# EAGLE design ControlBoardV2_PRO (EAGLE 9.6.2)
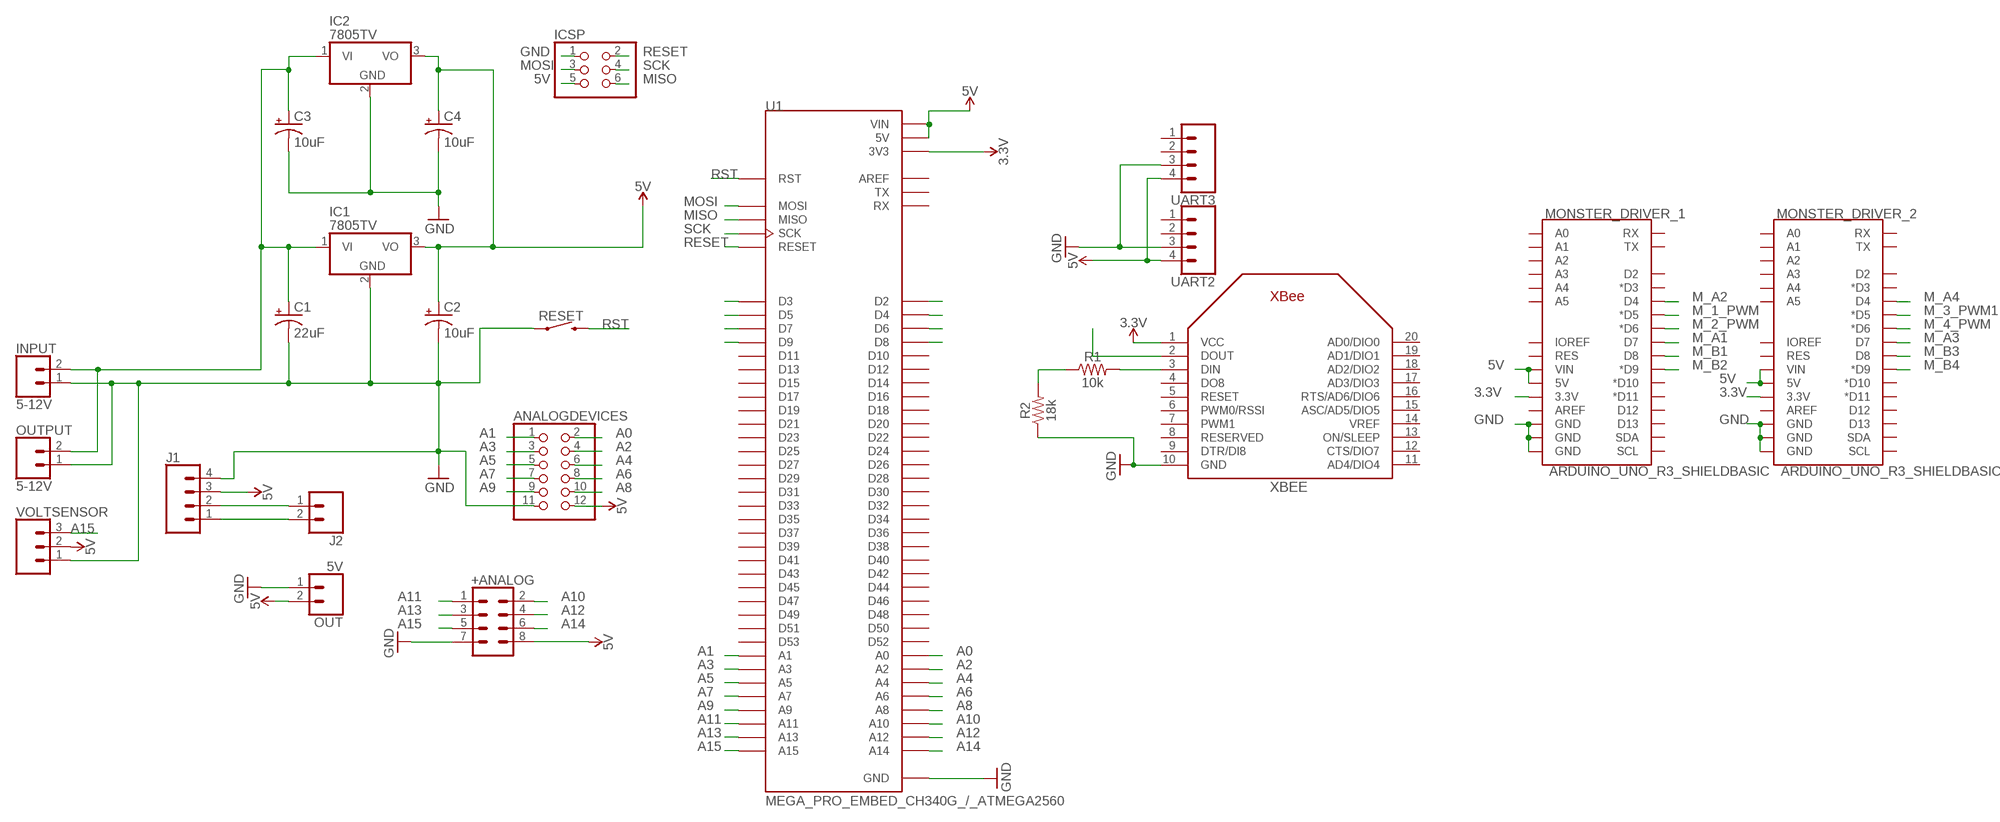
[diagram p0: schematic, sheet 1]

## Parts
+ANALOG  CONN_04X2  [2X4]
ANALOGDEVICES  PINHD-2X6  [2X06]
C1  22uF  CPOL-USE2.5-5  [E2,5-5]
C2  10uF  CPOL-USE2.5-5  [E2,5-5]
C3  10uF  CPOL-USE2.5-5  [E2,5-5]
C4  10uF  CPOL-USE2.5-5  [E2,5-5]
IC1  7805TV  [TO220V]
IC2  7805TV  [TO220V]
ICSP  PINHD-2X3  [2X03]
INPUT  5-12V  CONN_023.5MM  [SCREWTERMINAL-3.5MM-2]
J1  CONN_04  [1X04]
J2  CONN_02  [1X02]
MONSTER_DRIVER_1  ARDUINO_UNO_R3_SHIELDBASIC  [UNO_R3_SHIELD]
MONSTER_DRIVER_2  ARDUINO_UNO_R3_SHIELDBASIC  [UNO_R3_SHIELD]
OUT  5V  CONN_023.5MM  [SCREWTERMINAL-3.5MM-2]
OUTPUT  5-12V  CONN_023.5MM  [SCREWTERMINAL-3.5MM-2]
R1  10k  10KOHM-HORIZ-1/4W-1%  [AXIAL-0.3]
R2  18k  10KOHM-HORIZ-1/4W-1%  [AXIAL-0.3]
RESET  MOMENTARY-SWITCH-SPST-PTH-6.0MM  [TACTILE_SWITCH_PTH_6.0MM]
U1  MEGA_PRO_EMBED_CH340G_/_ATMEGA2560  [MODULE_MEGA_PRO_EMBED_CH340G_/_ATMEGA2560]
UART2  CONN_04  [1X04]
UART3  CONN_04  [1X04]
VOLTSENSOR  CONN_03  [1X03]
XBEE  XBEE  [XBEE]

## Nets
3.3V: MONSTER_DRIVER_1.3.3V MONSTER_DRIVER_2.3.3V U1.3V3_1(3V3) U1.3V3_2(3V3) XBEE.1(VCC)
5V: +ANALOG.8 ANALOGDEVICES.12 C2.+ C4.+ IC1.3(VO) IC2.3(VO) ICSP.5 J1.3 MONSTER_DRIVER_1.5V MONSTER_DRIVER_1.VIN MONSTER_DRIVER_2.5V MONSTER_DRIVER_2.VIN OUT.2 U1.5V_1(5V) U1.5V_2(5V) U1.5V_3(5V) U1.VIN_1(VIN) U1.VIN_2(VIN) UART2.4 UART3.4 VOLTSENSOR.2
A0: ANALOGDEVICES.2 U1.A0
A1: ANALOGDEVICES.1 U1.A1
A2: ANALOGDEVICES.4 U1.A2
A3: ANALOGDEVICES.3 U1.A3
A4: ANALOGDEVICES.6 U1.A4
A5: ANALOGDEVICES.5 U1.A5
A6: ANALOGDEVICES.8 U1.A6
A7: ANALOGDEVICES.7 U1.A7
A8: ANALOGDEVICES.10 U1.A8
A9: ANALOGDEVICES.9 U1.A9
A10: +ANALOG.2 U1.A10
A11: +ANALOG.1 U1.A11
A12: +ANALOG.4 U1.A12
A13: +ANALOG.3 U1.A13
A14: +ANALOG.6 U1.A14
A15: +ANALOG.5 U1.A15 VOLTSENSOR.3
GND: +ANALOG.7 ANALOGDEVICES.11 C1.- C2.- C3.- C4.- IC1.2(GND) IC2.2(GND) ICSP.1 INPUT.1 J1.4 MONSTER_DRIVER_1.GND@0(GND) MONSTER_DRIVER_1.GND@1(GND) MONSTER_DRIVER_1.GND@2(GND) MONSTER_DRIVER_2.GND@0(GND) MONSTER_DRIVER_2.GND@1(GND) MONSTER_DRIVER_2.GND@2(GND) OUT.1 OUTPUT.1 R2.P$1 RESET.1 U1.GND_1(GND) U1.GND_2(GND) U1.GND_3(GND) UART2.3 UART3.3 VOLTSENSOR.1 XBEE.10(GND)
M_1_PWM: MONSTER_DRIVER_1.D5(*D5)
M_2_PWM: MONSTER_DRIVER_1.D6(*D6)
M_3_PWM1: MONSTER_DRIVER_2.D5(*D5)
M_4_PWM: MONSTER_DRIVER_2.D6(*D6)
M_A1: MONSTER_DRIVER_1.D7
M_A2: MONSTER_DRIVER_1.D4
M_A3: MONSTER_DRIVER_2.D7
M_A4: MONSTER_DRIVER_2.D4
M_B1: MONSTER_DRIVER_1.D8
M_B2: MONSTER_DRIVER_1.D9(*D9)
M_B3: MONSTER_DRIVER_2.D8
M_B4: MONSTER_DRIVER_2.D9(*D9)
MISO: ICSP.6 U1.MISO
MISO1: U1.D4
MISO2: U1.D5
MOSI: ICSP.3 U1.MOSI
MOSI1: U1.D2
MOSI2: U1.D3
N$2: XBEE.2(DOUT)
N$7: R1.P$1 R2.P$2
N$9: R1.P$2 XBEE.3(DIN)
N$11: C1.+ C3.+ IC1.1(VI) IC2.1(VI) INPUT.2 OUTPUT.2
N$20: J1.1 J2.2
N$21: J1.2 J2.1
RESET: ICSP.2 U1.RESET
RESET1: U1.D8
RESET2: U1.D9
RST: RESET.3 U1.RST
SCK: ICSP.4 U1.SCK
SCK1: U1.D6
SCK2: U1.D7
Unconnected: MONSTER_DRIVER_1.A0 MONSTER_DRIVER_1.A1 MONSTER_DRIVER_1.A2 MONSTER_DRIVER_1.A3 MONSTER_DRIVER_1.A4 MONSTER_DRIVER_1.A5 MONSTER_DRIVER_1.AREF MONSTER_DRIVER_1.D2 MONSTER_DRIVER_1.D3(*D3) MONSTER_DRIVER_1.D10(*D10) MONSTER_DRIVER_1.D11(*D11) MONSTER_DRIVER_1.D12 MONSTER_DRIVER_1.D13 MONSTER_DRIVER_1.IOREF MONSTER_DRIVER_1.RES MONSTER_DRIVER_1.RX MONSTER_DRIVER_1.SCL MONSTER_DRIVER_1.SDA MONSTER_DRIVER_1.TX MONSTER_DRIVER_2.A0 MONSTER_DRIVER_2.A1 MONSTER_DRIVER_2.A2 MONSTER_DRIVER_2.A3 MONSTER_DRIVER_2.A4 MONSTER_DRIVER_2.A5 MONSTER_DRIVER_2.AREF MONSTER_DRIVER_2.D2 MONSTER_DRIVER_2.D3(*D3) MONSTER_DRIVER_2.D10(*D10) MONSTER_DRIVER_2.D11(*D11) MONSTER_DRIVER_2.D12 MONSTER_DRIVER_2.D13 MONSTER_DRIVER_2.IOREF MONSTER_DRIVER_2.RES MONSTER_DRIVER_2.RX MONSTER_DRIVER_2.SCL MONSTER_DRIVER_2.SDA MONSTER_DRIVER_2.TX U1.AREF U1.D10 U1.D11 U1.D12 U1.D13 U1.D14 U1.D15 U1.D16 U1.D17 U1.D18 U1.D19 U1.D20 U1.D21 U1.D22 U1.D23 U1.D24 U1.D25 U1.D26 U1.D27 U1.D28 U1.D29 U1.D30 U1.D31 U1.D32 U1.D33 U1.D34 U1.D35 U1.D36 U1.D37 U1.D38 U1.D39 U1.D40 U1.D41 U1.D42 U1.D43 U1.D44 U1.D45 U1.D46 U1.D47 U1.D48 U1.D49 U1.D50 U1.D51 U1.D52 U1.D53 U1.RX U1.TX UART2.1 UART2.2 UART3.1 UART3.2 XBEE.4(DO8) XBEE.5(RESET) XBEE.6(PWM0/RSSI) XBEE.7(PWM1) XBEE.8(RESERVED) XBEE.9(DTR/DI8) XBEE.11(AD4/DIO4) XBEE.12(CTS/DIO7) XBEE.13(ON/SLEEP) XBEE.14(VREF) XBEE.15(ASC/AD5/DIO5) XBEE.16(RTS/AD6/DIO6) XBEE.17(AD3/DIO3) XBEE.18(AD2/DIO2) XBEE.19(AD1/DIO1) XBEE.20(AD0/DIO0)

## Library data of the parts
+ANALOG = SparkFun-Connectors:CONN_04X2: Multi connection point. Often used as Generic Header-pin footprint for 0.1 inch spaced/style header connections On any of the 0.1 inch spaced packages, you can populate with these: Break Away Headers - Straight <https://www.sparkfun.com/products/116> (PRT-00116) Break Away Male Headers - Right Angle <https://www.sparkfun.com/products/553> (PRT-00553) Female Headers <https://www.sparkfun.com/products/115> (PRT-00115) Break Away Headers - Machine Pin <https://www.sparkfun.com/products/117> (PRT-00117) Break Away Female Headers - Swiss Machine Pin <https://www.sparkfun.com/products/743> (PRT-00743)
ANALOGDEVICES = pinhead:PINHD-2X6: PIN HEADER
C1-C4 = adafruit:CPOL-US: POLARIZED CAPACITOR, American symbol
IC1 IC2 = linear:78*: Positive VOLTAGE REGULATOR Source: http://cache.national.com/ds/LM/LM78L05.pdf http://www.fairchildsemi.com/ds/LM/LM7805.pdf
ICSP = pinhead:PINHD-2X3: PIN HEADER
INPUT OUT OUTPUT = SparkFun-Connectors:CONN_02: Multi connection point. Often used as Generic Header-pin footprint for 0.1 inch spaced/style header connections On any of the 0.1 inch spaced packages, you can populate with these: Break Away Headers - Straight <https://www.sparkfun.com/products/116> (PRT-00116) Break Away Male Headers - Right Angle <https://www.sparkfun.com/products/553> (PRT-00553) Female Headers <https://www.sparkfun.com/products/115> (PRT-00115) Break Away Headers - Machine Pin <https://www.sparkfun.com/products/117> (PRT-00117) Break Away Female Headers - Swiss Machine Pin <https://www.sparkfun.com/products/743> (PRT-00743) For SCREWTERMINALS and SPRING TERMINALS visit here: Screw Terimnals on SparkFun.com <https://www.sparkfun.com/search/results?term=Screw+Terminals> (5mm/3.5mm/2.54mm spacing) This device is also useful as a general connection point to wire up your design to another part of your project. Our various solder wires solder well into these plated through hole pads. Hook-Up Wire - Assortment (Stranded, 22 AWG) <https://www.sparkfun.com/products/11375> (PRT-11375) Hook-Up Wire - Assortment (Solid Core, 22 AWG) <https://www.sparkfun.com/products/11367> (PRT-11367) View the entire wire category on our website here <https://www.sparkfun.com/categories/141> Special notes: Molex polarized connector foot print use with: PRT-08233 with associated crimp pins and housings. 2.54_SCREWTERM for use with PRT-10571. 3.5mm Screw Terminal footprints for PRT-08084 5mm Screw Terminal footprints for use with PRT-08432; PROD_ID: CONN-08399
J1 UART2 UART3 = SparkFun-Connectors:CONN_04: Multi connection point. Often used as Generic Header-pin footprint for 0.1 inch spaced/style header connections On any of the 0.1 inch spaced packages, you can populate with these: Break Away Headers - Straight <https://www.sparkfun.com/products/116> (PRT-00116) Break Away Male Headers - Right Angle <https://www.sparkfun.com/products/553> (PRT-00553) Female Headers <https://www.sparkfun.com/products/115> (PRT-00115) Break Away Headers - Machine Pin <https://www.sparkfun.com/products/117> (PRT-00117) Break Away Female Headers - Swiss Machine Pin <https://www.sparkfun.com/products/743> (PRT-00743) For SCREWTERMINALS and SPRING TERMINALS visit here: Screw Terimnals on SparkFun.com <https://www.sparkfun.com/search/results?term=Screw+Terminals> (5mm/3.5mm/2.54mm spacing) This device is also useful as a general connection point to wire up your design to another part of your project. Our various solder wires solder well into these plated through hole pads. Hook-Up Wire - Assortment (Stranded, 22 AWG) <https://www.sparkfun.com/products/11375> (PRT-11375) Hook-Up Wire - Assortment (Solid Core, 22 AWG) <https://www.sparkfun.com/products/11367> (PRT-11367) View the entire wire category on our website here <https://www.sparkfun.com/categories/141> Special notes: Molex polarized connector foot print use with SKU : PRT-08231 with associated crimp pins and housings. 1MM SMD Version SKU: PRT-10208; PROD_ID: CONN-09696
J2 = SparkFun-Connectors:CONN_02: Multi connection point. Often used as Generic Header-pin footprint for 0.1 inch spaced/style header connections On any of the 0.1 inch spaced packages, you can populate with these: Break Away Headers - Straight <https://www.sparkfun.com/products/116> (PRT-00116) Break Away Male Headers - Right Angle <https://www.sparkfun.com/products/553> (PRT-00553) Female Headers <https://www.sparkfun.com/products/115> (PRT-00115) Break Away Headers - Machine Pin <https://www.sparkfun.com/products/117> (PRT-00117) Break Away Female Headers - Swiss Machine Pin <https://www.sparkfun.com/products/743> (PRT-00743) For SCREWTERMINALS and SPRING TERMINALS visit here: Screw Terimnals on SparkFun.com <https://www.sparkfun.com/search/results?term=Screw+Terminals> (5mm/3.5mm/2.54mm spacing) This device is also useful as a general connection point to wire up your design to another part of your project. Our various solder wires solder well into these plated through hole pads. Hook-Up Wire - Assortment (Stranded, 22 AWG) <https://www.sparkfun.com/products/11375> (PRT-11375) Hook-Up Wire - Assortment (Solid Core, 22 AWG) <https://www.sparkfun.com/products/11367> (PRT-11367) View the entire wire category on our website here <https://www.sparkfun.com/categories/141> Special notes: Molex polarized connector foot print use with: PRT-08233 with associated crimp pins and housings. 2.54_SCREWTERM for use with PRT-10571. 3.5mm Screw Terminal footprints for PRT-08084 5mm Screw Terminal footprints for use with PRT-08432
MONSTER_DRIVER_1 MONSTER_DRIVER_2 = SparkFun-Boards:ARDUINO_UNO_R3_SHIELD: Arduino R3 Shield Footprint Shield form compatible with the Arduino Uno R3. SparkFun Products: MG2639 Cellular Shield <https://www.sparkfun.com/products/13120> MIDI Shield <https://www.sparkfun.com/products/12898> R3 Stackable Headers Kit <https://www.sparkfun.com/products/11417>
R1 = SparkFun-Resistors:10KOHM: 10kΩ resistor A resistor is a passive two-terminal electrical component that implements electrical resistance as a circuit element. Resistors act to reduce current flow, and, at the same time, act to lower voltage levels within circuits. - Wikipedia; PROD_ID: RES-12183
R2 = SparkFun-Resistors:10KOHM: 10kΩ resistor A resistor is a passive two-terminal electrical component that implements electrical resistance as a circuit element. Resistors act to reduce current flow, and, at the same time, act to lower voltage levels within circuits. - Wikipedia; PROD_ID: RES-12183; VALUE: 10k
RESET = SparkFun-Switches:MOMENTARY-SWITCH-SPST: Momentary Switch (Pushbutton) - SPST Normally-open (NO) SPST momentary switches (buttons, pushbuttons). Variants PTH-12MM - 12mm square, through-hole Momentary Pushbutton Switch - 12mm Square <https://www.sparkfun.com/products/9190> (COM-09190) PTH-6.0MM, PTH-6.0MM-KIT - 6.0mm square, through-hole Mini Pushbutton Switch <https://www.sparkfun.com/products/97> (COM-00097) KIT package intended for soldering kit's - only one side of pads' copper is exposed. PTH-RIGHT-ANGLE-KIT - Right-angle, through-hole Right Angle Tactile Button <https://www.sparkfun.com/products/10791> - Used on SparkFun BigTime Watch Kit <https://www.sparkfun.com/products/11734> SMD-12MM - 12mm square, surface-mount Tactile Button - SMD (12mm) <https://www.sparkfun.com/products/12993> (COM-12993) Used on SparkFun PicoBoard <https://www.sparkfun.com/products/11888> SMD-4.5MM - 4.5mm Square Trackball Switch Used on SparkFun Blackberry Trackballer Breakout <https://www.sparkfun.com/products/13169> SMD-4.6MMX2.8MM - 4.60mm x 2.80mm, surface mount Used on SparkFun SAMD21 Mini Breakout <https://www.sparkfun.com/products/13664> SMD-5.2MM, SMD-5.2-REDUNDANT - 5.2mm square, surface-mount Mini Pushbutton Switch - SMD <https://www.sparkfun.com/products/8720> (COM-08720) Used on Arduino Pro Mini <https://www.sparkfun.com/products/11114> REDUNDANT package connects both switch circuits together SMD-6.0X3.5MM - 6.0 x 3.5mm, surface mount Momentary Reset Switch SMD <https://www.sparkfun.com/products/8229> (COM-08229) SMD-6.2MM-TALL - 6.2mm square, surface mount Tactile Button - SMD (6mm) <https://www.sparkfun.com/products/12992> Used on SparkFun Digital Sandbox <https://www.sparkfun.com/products/12651> SMD-RIGHT-ANGLE - Right-angle, surface mount Used on SparkFun Block for Intel® Edison - Arduino <https://www.sparkfun.com/products/13036>; PROD_ID: SWCH-08441; SF_SKU: COM-00097
U1 = MEGA_PRO_EMBED_CH340G___ATMEGA2560:MEGA_PRO_EMBED_CH340G_/_ATMEGA2560: Mega 2560 PRO (Embed) CH340G/ATmega2560-16AU Check availability <https://pricing.snapeda.com/parts/Mega%20Pro%20Embed%20CH340G%20/%20ATmega2560/Robotdyn/view-part?ref=eda>; AVAILABILITY: Not in stock; MF: Robotdyn; MP: Mega Pro Embed CH340G / ATmega2560; PACKAGE: None; PRICE: None
VOLTSENSOR = SparkFun-Connectors:CONN_03: Multi connection point. Often used as Generic Header-pin footprint for 0.1 inch spaced/style header connections On any of the 0.1 inch spaced packages, you can populate with these: Break Away Headers - Straight <https://www.sparkfun.com/products/116> (PRT-00116) Break Away Male Headers - Right Angle <https://www.sparkfun.com/products/553> (PRT-00553) Female Headers <https://www.sparkfun.com/products/115> (PRT-00115) Break Away Headers - Machine Pin <https://www.sparkfun.com/products/117> (PRT-00117) Break Away Female Headers - Swiss Machine Pin <https://www.sparkfun.com/products/743> (PRT-00743) Stackable Header - 3 Pin (Female, 0.1") <https://www.sparkfun.com/products/13875> (PRT-13875) For SCREWTERMINALS and SPRING TERMINALS visit here: Screw Terimnals on SparkFun.com <https://www.sparkfun.com/search/results?term=Screw+Terminals> (5mm/3.5mm/2.54mm spacing) This device is also useful as a general connection point to wire up your design to another part of your project. Our various solder wires solder well into these plated through hole pads. Hook-Up Wire - Assortment (Stranded, 22 AWG) <https://www.sparkfun.com/products/11375> (PRT-11375) Hook-Up Wire - Assortment (Solid Core, 22 AWG) <https://www.sparkfun.com/products/11367> (PRT-11367) View the entire wire category on our website here <https://www.sparkfun.com/categories/141> Special notes: Molex polarized connector foot print use with SKU : PRT-08232 with associated crimp pins and housings.
XBEE = adafruit:XBEE

## Board
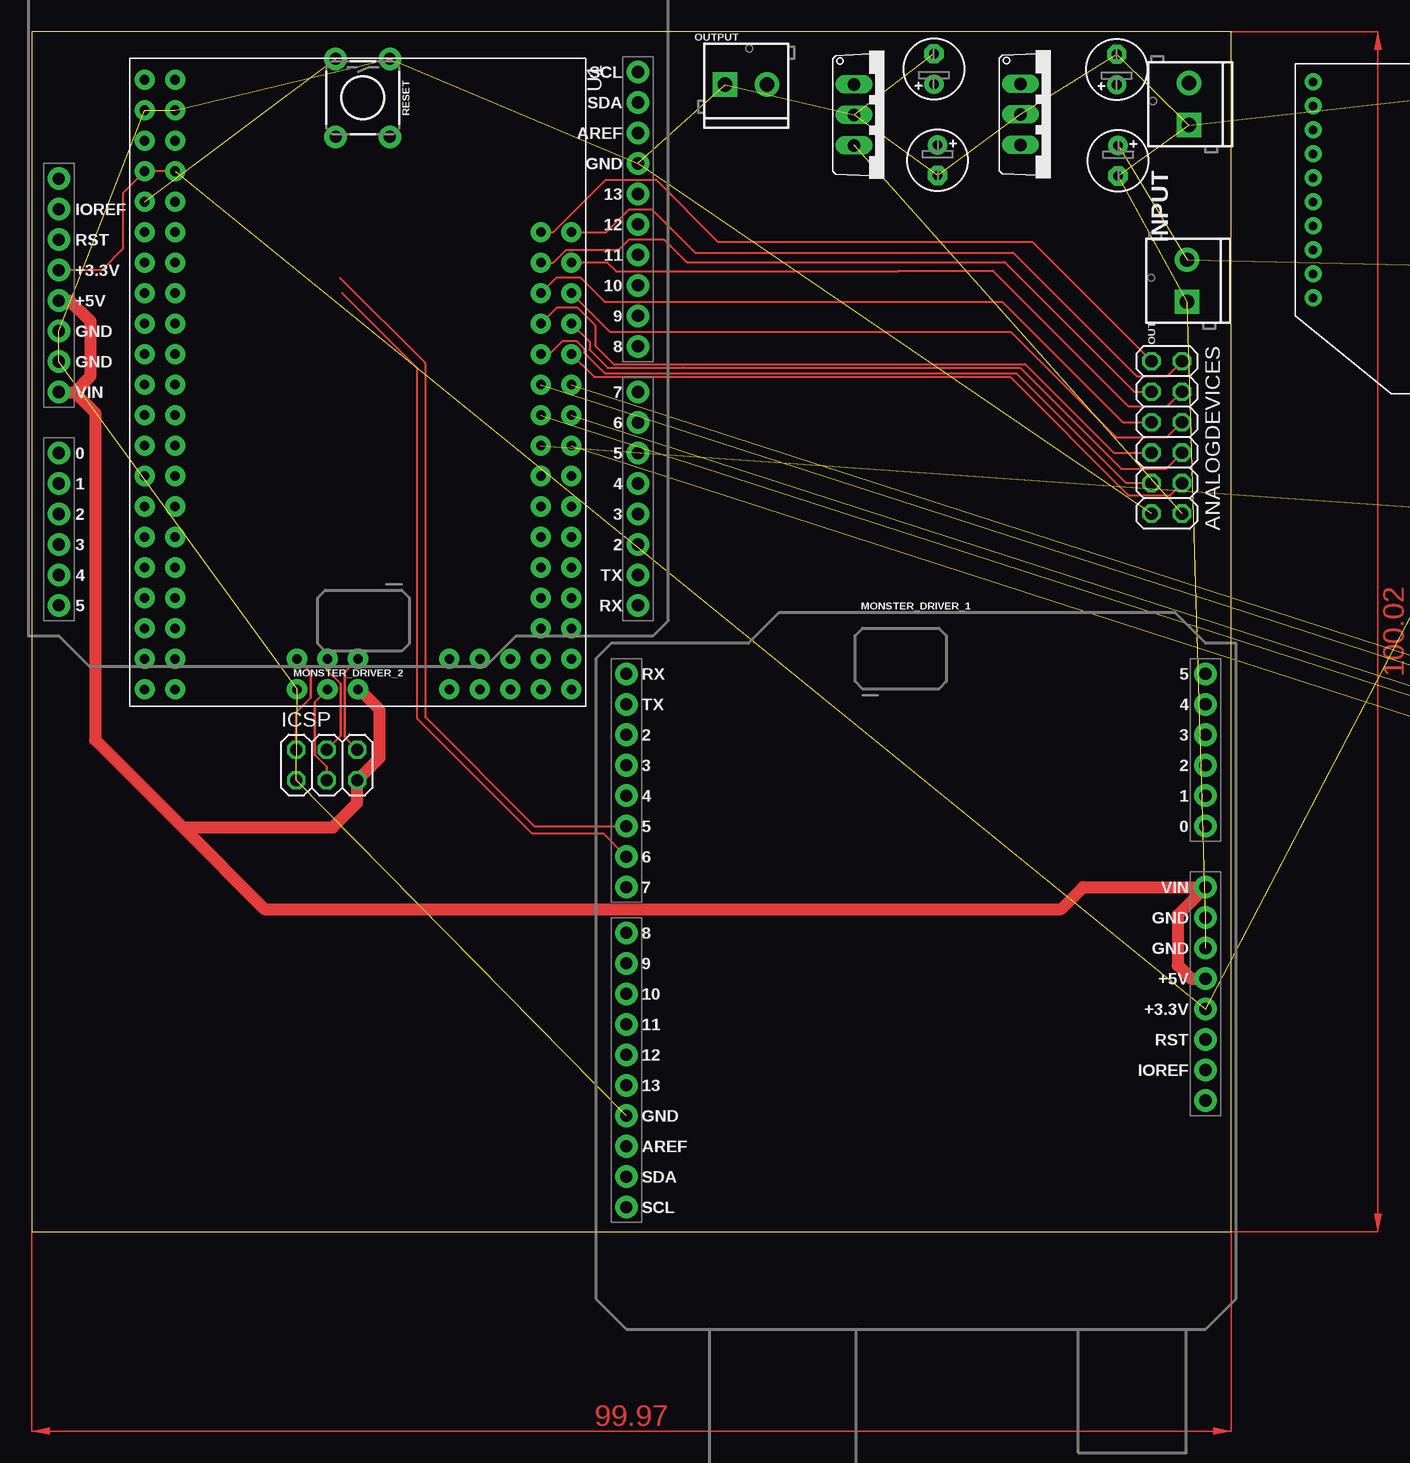
[diagram p1: board, top side]
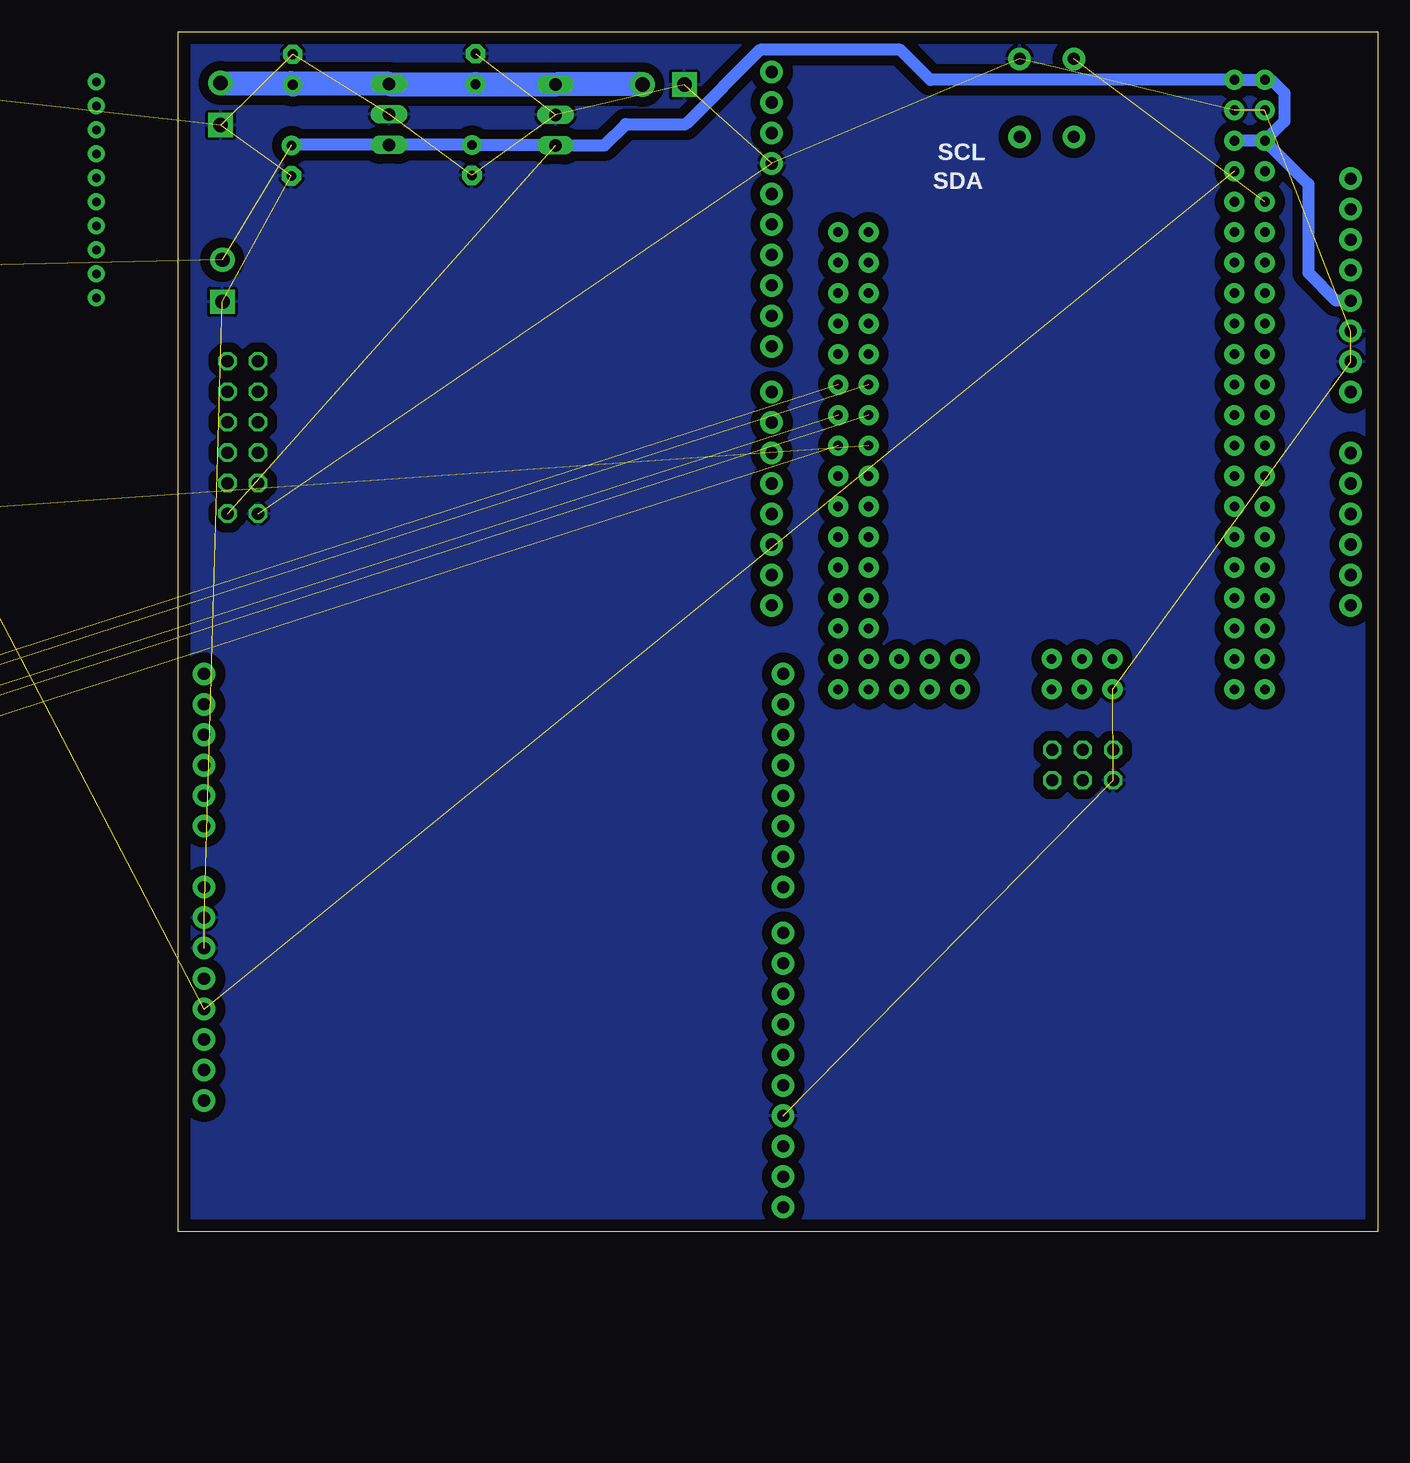
[diagram p2: board, bottom side, seen from below]

Size 99.97 x 100.02 mm. Coordinates in mm from the lower left corner, seen from the top.
Outline: 0,0 99.97,0 99.97,100.02 0,100.02 0,0
Copper layers (1*16): Top 0.035mm / dielectric 1.5mm / Bottom 0.035mm
Design rules "default *": minimum track width 6mil, minimum drill 0.3mm, track to track 6mil, track to pad 6mil, pad to pad 6mil, via to via 6mil, smd to smd 6mil, copper to edge 40mil, drill to drill 6mil, minimum pad ring 10mil, minimum via ring 8mil, stop-mask expansion 4mil, vias tented up to drill 0mil, thermal gap 10mil

### Footprints (pad centres in the part's own frame; a part is rotated, then mirrored left to right if it is on the bottom)
2X4 = drill 1.016 pad 1.88: 1 -3.81,-1.27; 2 -3.81,1.27; 3 -1.27,-1.27; 4 -1.27,1.27; 5 1.27,-1.27; 6 1.27,1.27; 7 3.81,-1.27; 8 3.81,1.27
2X06 = drill 1.016 octagon: 1 -6.35,-1.27; 2 -6.35,1.27; 3 -3.81,-1.27; 4 -3.81,1.27; 5 -1.27,-1.27; 6 -1.27,1.27; 7 1.27,-1.27; 8 1.27,1.27; 9 3.81,-1.27; 10 3.81,1.27; 11 6.35,-1.27; 12 6.35,1.27
E2,5-5 = drill 0.813 pad 1.6: + -1.27,0 | drill 0.813 pad 1.6 octagon: - 1.27,0
TO220V = drill 1.016 long: 1 -2.54,-2.54; 2 0,-2.54; 3 2.54,-2.54
2X03 = drill 1.016 octagon: 1 -2.54,-1.27; 2 -2.54,1.27; 3 0,-1.27; 4 0,1.27; 5 2.54,-1.27; 6 2.54,1.27
SCREWTERMINAL-3.5MM-2 = drill 1.2 pad 2.032 square: 1 0,0 | drill 1.2 pad 2.032: 2 3.5,0
1X04 = drill 1.016 pad 1.88: 1 0,0; 2 2.54,0; 3 5.08,0; 4 7.62,0
1X02 = drill 1.016 pad 1.88: 1 0,0; 2 2.54,0
UNO_R3_SHIELD = drill 1.016 pad 1.88: 3.3V 24.13,-2.54; 5V 24.13,0; A0 24.13,12.7; A1 24.13,15.24; A2 24.13,17.78; A3 24.13,20.32; A4 24.13,22.86; A5 24.13,25.4; AREF -24.13,-13.97; D2 -24.13,20.32; D3 -24.13,17.78; D4 -24.13,15.24; D5 -24.13,12.7; D6 -24.13,10.16; D7 -24.13,7.62; D8 -24.13,3.81; D9 -24.13,1.27; D10 -24.13,-1.27; D11 -24.13,-3.81; D12 -24.13,-6.35; D13 -24.13,-8.89; GND@0 24.13,2.54; GND@1 24.13,5.08; GND@2 -24.13,-11.43; IOREF 24.13,-7.62; NC 24.13,-10.16; RES 24.13,-5.08; RX -24.13,25.4; SCL -24.13,-19.05; SDA -24.13,-16.51; TX -24.13,22.86; VIN 24.13,7.62
AXIAL-0.3 = drill 0.9 pad 1.88: P$1 -3.81,0; P$2 3.81,0
TACTILE_SWITCH_PTH_6.0MM = drill 1.016 pad 1.88: 1 -3.251,2.261; 2 3.251,2.261; 3 -3.251,-2.261; 4 3.251,-2.261
MODULE_MEGA_PRO_EMBED_CH340G_/_ATMEGA2560 = drill 0.8 pad 1.676: 3V3_1 -17.58,-17.78; 3V3_2 -17.58,-15.24; 5V_1 -20.12,-17.78; 5V_2 -20.12,-15.24; 5V_3 25.6,0; A0 -12.5,17.78; A1 -12.5,15.24; A2 -9.96,17.78; A3 -9.96,15.24; A4 -7.42,17.78; A5 -7.42,15.24; A6 -4.88,17.78; A7 -4.88,15.24; A8 -2.34,17.78; A9 -2.34,15.24; A10 0.2,17.78; A11 0.2,15.24; A12 2.74,17.78; A13 2.74,15.24; A14 5.28,17.78; A15 5.28,15.24; AREF -15.04,-15.24; D2 -9.96,-15.24; D3 -9.96,-17.78; D4 -7.42,-15.24; D5 -7.42,-17.78; D6 -4.88,-15.24; D7 -4.88,-17.78; D8 -2.34,-15.24; D9 -2.34,-17.78; D10 0.2,-15.24; D11 0.2,-17.78; D12 2.74,-15.24; D13 2.74,-17.78; D14 5.28,-15.24; D15 5.28,-17.78; D16 7.82,-15.24; D17 7.82,-17.78; D18 10.36,-15.24; D19 10.36,-17.78; D20 12.9,-15.24; D21 12.9,-17.78; D22 15.44,-15.24; D23 15.44,-17.78; D24 17.98,-15.24; D25 17.98,-17.78; D26 20.52,-15.24; D27 20.52,-17.78; D28 23.06,-15.24; D29 23.06,-17.78; D30 25.6,-15.24; D31 25.6,-17.78; D32 7.82,17.78; D33 7.82,15.24; D34 10.36,17.78; D35 10.36,15.24; D36 12.9,17.78; D37 12.9,15.24; D38 15.44,17.78; D39 15.44,15.24; D40 17.98,17.78; D41 17.98,15.24; D42 20.52,17.78; D43 20.52,15.24; D44 23.06,17.78; D45 23.06,15.24; D46 25.6,17.78; D47 25.6,15.24; D48 25.6,12.7; D49 23.06,12.7; D50 25.6,10.16; D51 23.06,10.16; D52 25.6,7.62; D53 23.06,7.62; GND_1 -22.66,-17.78; GND_2 -22.66,-15.24; GND_3 25.6,-5.08; MISO 23.06,0; MOSI 25.6,-2.54; RESET 23.06,-5.08; RST -15.04,-17.78; RX -12.5,-15.24; SCK 23.06,-2.54; TX -12.5,-17.78; VIN_1 -25.2,-17.78; VIN_2 -25.2,-15.24
1X03 = drill 1.016 pad 1.88: 1 0,0; 2 2.54,0; 3 5.08,0
XBEE = drill 0.7 pad 1.422 square: 1 -11,5.5 | drill 0.7 pad 1.422: 2 -11,3.5; 3 -11,1.5; 4 -11,-0.5; 5 -11,-2.5; 6 -11,-4.5; 7 -11,-6.5; 8 -11,-8.5; 9 -11,-10.5; 10 -11,-12.5; 11 11,-12.5; 12 11,-10.5; 13 11,-8.5; 14 11,-6.5; 15 11,-4.5; 16 11,-2.5; 17 11,-0.5; 18 11,1.5; 19 11,3.5; 20 11,5.5

### Placement (x,y rotation side)
+ANALOG  165.9,27.4 270 top  (outside the outline)
ANALOGDEVICES  94.6,66.2 270 top
C1  90.43,96.86 90 top
C2  90.54,89.26 270 top
C3  75.2,96.9 90 top
C4  75.5,89.3 270 top
IC1  84.95,93.11 270 top
IC2  71.08,93.07 270 top
ICSP  24.6,38.9 0 top
INPUT  96.45,92.23 90 top
J1  154.4,72.1 90 top  (outside the outline)
J2  194.4,97 270 top  (outside the outline)
MONSTER_DRIVER_1  73.7,21.1 0 top
MONSTER_DRIVER_2  26.4,77.6 180 top
OUT  96.3,77.5 90 top
OUTPUT  57.8,95.6 0 top
R1  167.02,46.66 270 top  (outside the outline)
R2  159.26,50.26 0 top  (outside the outline)
RESET  27.6,94.5 270 top
U1  27.2,70.8 270 top
UART2  146.01,72.27 90 top  (outside the outline)
UART3  150.24,72.27 90 top  (outside the outline)
VOLTSENSOR  129.9,59 0 top  (outside the outline)
XBEE  117.8,83.33 180 top  (outside the outline)

### Tracks (layer width: path | path; a pad name or v marks a point on that pad's centre or on a via)
3.3V  (2 unrouted)
  Top 0.152: U1.3V3_2 U1.3V3_1 7.6,86.56 7.6,81.9 5.84,80.14 MONSTER_DRIVER_2.3.3V
5V  (7 unrouted)
  Top 1.016: MONSTER_DRIVER_2.5V 3.2,77.6 4.9,75.9 4.9,71.3 3.58,69.98 | MONSTER_DRIVER_2.VIN 3.58,69.98 | 3.58,69.98 5.3,68.26 5.3,41 12.6,33.7 | 12.6,33.7 25.1,33.7 27.14,35.74 ICSP.5 29,39.49 29,43.5 27.3,45.2 U1.5V_3 | 12.6,33.7 19.4,26.9 85.8,26.9 87.62,28.72 MONSTER_DRIVER_1.VIN 95.5,26.39 95.5,22.2 96.6,21.1 MONSTER_DRIVER_1.5V
  Bottom 1.016: C2.+ 90.5,90.57 IC1.3 C4.+ 75.46,90.53 IC2.3 64.47,90.53 62.7,92.3 57.7,92.3 51.5,98.5 39.8,98.5 37.3,96 U1.VIN_2 U1.VIN_1 8.9,96 7.8,94.9 7.8,92.54 U1.5V_1 | U1.5V_1 U1.5V_2 | U1.5V_1 5.8,87.3 5.8,79.9 3.5,77.6 MONSTER_DRIVER_2.5V
A0
  Top 0.152: U1.A0 47.9,83.3 49.8,85.2 51.7,85.2 54.1,82.8 54.15,82.75 54.2,82.7 55.3,81.6 81.8,81.6 92.1,71.3 94.62,71.3 ANALOGDEVICES.2
A1
  Top 0.152: U1.A1 43.47,83.3 47.83,87.66 50.9,87.66 51.01,87.66 51.96,87.66 52,87.7 57.2,82.5 83.38,82.5 ANALOGDEVICES.1
A2
  Top 0.152: U1.A2 47.99,80.76 48.71,80.04 72.24,80.04 72.3,80.1 80.1,80.1 91.4,68.8 94.66,68.8 ANALOGDEVICES.4
A3
  Top 0.152: U1.A3 43.47,80.76 44.54,81.83 48.93,81.83 49.8,82.7 52.7,82.7 54.6,80.8 81.1,80.8 91.9,70 ANALOGDEVICES.3
A4
  Top 0.152: U1.A4 48.2,75 81.6,75 90.4,66.2 94.6,66.2 ANALOGDEVICES.6
A5
  Top 0.152: U1.A5 43.72,79.5 45.75,79.5 47.75,77.5 80.9,77.5 90.93,67.47 ANALOGDEVICES.5
A6
  Top 0.152: U1.A6 46.5,74.16 46.5,73.5 48,72 54.2,72 54.33,72 82.4,72 90.8,63.6 94.54,63.6 ANALOGDEVICES.8
A7
  Top 0.152: U1.A7 43.75,77 45.5,77 47,75.5 47,73.81 48.5,72.31 82.8,72.31 90.2,64.9 93.3,64.9 ANALOGDEVICES.7
A8
  Top 0.152: U1.A8 46.87,71.25 81.55,71.25 91.4,61.4 94.88,61.4 ANALOGDEVICES.10
A9
  Top 0.152: U1.A9 43.14,73.14 44.25,74.25 45.38,74.25 46.05,73.58 46.05,73.26 47.75,71.56 82.05,71.56 82.1,71.5 91.21,62.39 ANALOGDEVICES.9
A10  (1 unrouted)
A11  (1 unrouted)
A12  (1 unrouted)
A13  (1 unrouted)
A14  (1 unrouted)
A15  (2 unrouted)
GND  (27 unrouted)
  pour Bottom (isolate 0.813): 3.2,100 3.2,99.2 0.4,96.4 0.4,0.1 99.7,0.1 99.7,100
M_1_PWM
  Top 0.152: MONSTER_DRIVER_1.D5 41.9,33.8 32.8,42.9 32.8,72.4 25.7,79.5
M_2_PWM
  Top 0.152: MONSTER_DRIVER_1.D6 47.63,33.2 41.7,33.2 32.1,42.8 32.1,72 25.88,78.22
MISO
  Top 0.2: ICSP.6 26.1,41.21 26.1,46.64 U1.MISO
MOSI
  Top 0.2: ICSP.3 24.6,38.73 23.59,39.75 23.59,44.13 U1.MOSI
N$7  (1 unrouted)
N$9  (1 unrouted)
N$11
  Bottom 2: INPUT.2 90.57,95.73 90.47,95.63 | 90.47,95.63 C1.+ | 90.47,95.63 90.45,95.65 IC1.1 82.39,95.63 C3.+ 75.18,95.61 IC2.1 61.31,95.61 OUTPUT.2
N$20  (1 unrouted)
N$21  (1 unrouted)
RESET
  Top 0.2: ICSP.2 22.06,43.31 23.25,44.5 23.25,46.61 U1.RESET
RST  (1 unrouted)
SCK
  Top 0.2: U1.SCK 24.66,46.74 25.75,45.65 25.75,41.32 ICSP.4
(copper drawn outside any net)
  shapes: Top area x2

### Text on the board
bNames: SCL | SDA